# EAGLE design modbus_energy_meter (EAGLE 6.1)
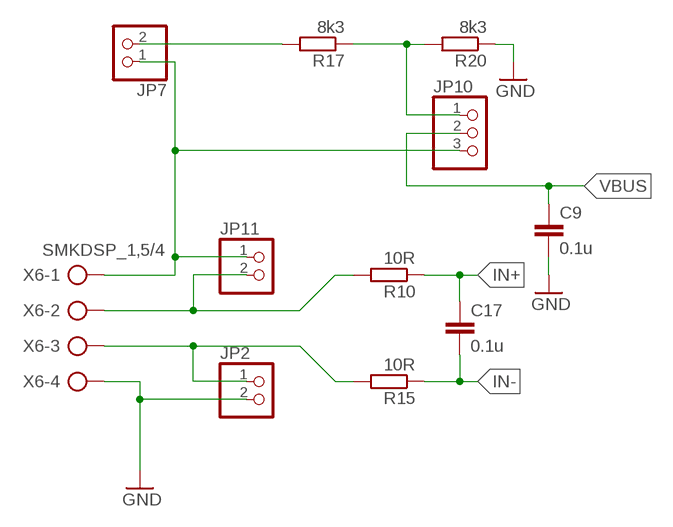
[diagram p0: schematic, sheet 1, part 1 of 2]
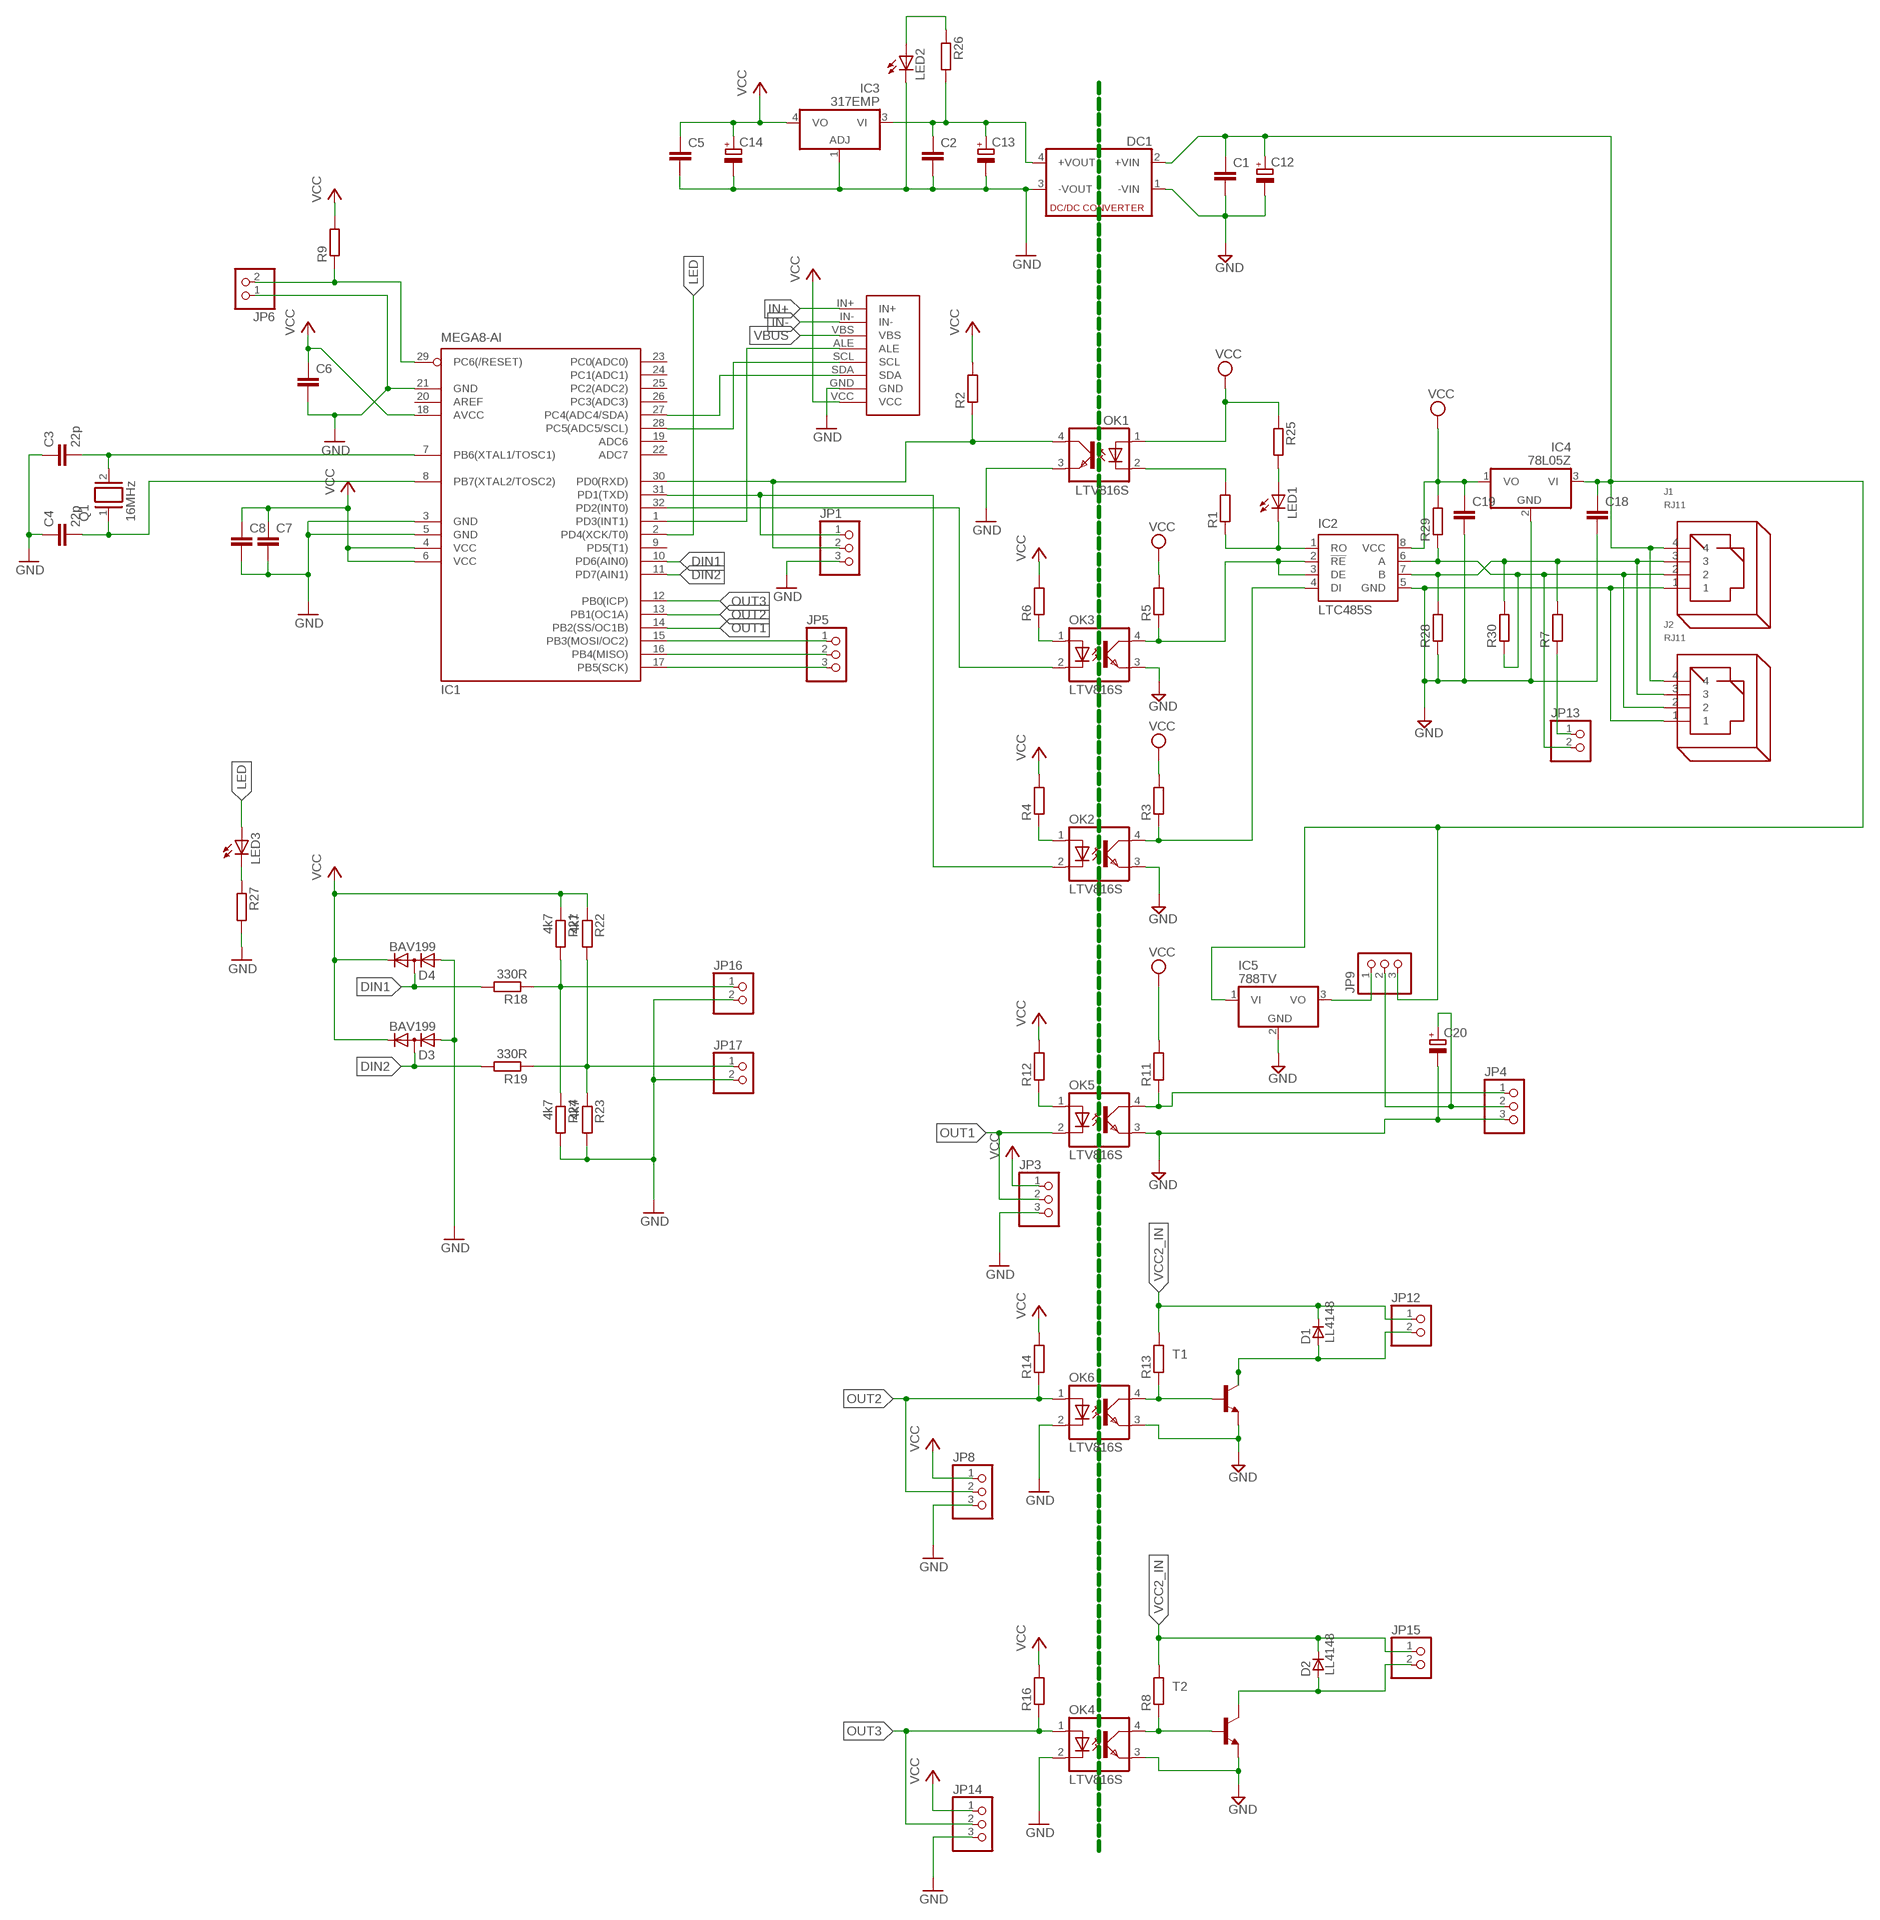
[diagram p1: schematic, sheet 1, part 2 of 2]

## Parts
C1  C-EUC0805  [C0805]
C2  C-EUC0805  [C0805]
C3  22p  C-EUC0805  [C0805]
C4  22p  C-EUC0805  [C0805]
C5  C-EUC0805  [C0805]
C6  C-EUC0805  [C0805]
C7  C-EUC0805  [C0805]
C8  C-EUC0805  [C0805]
C9  0.1u  C-EUC0805  [C0805]
C12  CPOL-EUE2.5-6  [E2,5-6]
C13  CPOL-EUE2.5-5  [E2,5-5]
C14  CPOL-EUE2.5-5  [E2,5-5]
C17  0.1u  C-EUC0805  [C0805]
C18  C-EUC0805  [C0805]
C19  C-EUC0805  [C0805]
C20  CPOL-EUE2.5-5  [E2,5-5]
D1  LL4148  [SOD80_DO213AA_MINIMELF]
D2  LL4148  [SOD80_DO213AA_MINIMELF]
D3  BAV199  [SOT23]
D4  BAV199  [SOT23]
DC1  NME  [NME]
IC1  MEGA8-AI  [TQFP32-08]
IC2  LTC485S  [SOIC8]
IC3  317EMP  [SOT223]
IC4  78L05Z  [TO92]
IC5  788TV  [TO220V]
J1  RJ11  [RJ11]
J2  RJ11  [RJ11]
JP1  PINHD-1X3  [1X03]
JP2  PINHD-1X2  [1X02]
JP3  PINHD-1X3  [1X03]
JP4  PINHD-1X3  [1X03]
JP5  PINHD-1X3  [1X03]
JP6  PINHD-1X2  [1X02]
JP7  PINHD-1X2  [1X02]
JP8  PINHD-1X3  [1X03]
JP9  PINHD-1X3  [1X03]
JP10  PINHD-1X3  [1X03]
JP11  PINHD-1X2  [1X02]
JP12  PINHD-1X2  [1X02]
JP13  PINHD-1X2  [1X02]
JP14  PINHD-1X3  [1X03]
JP15  PINHD-1X2  [1X02]
JP16  PINHD-1X2  [1X02]
JP17  PINHD-1X2  [1X02]
LED1  LEDCHIPLED_0805  [CHIPLED_0805]
LED2  LEDCHIPLED_0805  [CHIPLED_0805]
LED3  LEDCHIPLED_0805  [CHIPLED_0805]
OK1  LTV816S  [SMD4]
OK2  LTV816S  [SMD4]
OK3  LTV816S  [SMD4]
OK4  LTV816S  [SMD4]
OK5  LTV816S  [SMD4]
OK6  LTV816S  [SMD4]
Q1  16MHz  XTAL/S  [QS]
R1  R-EU_R1206  [R1206]
R2  R-EU_R0805  [R0805]
R3  R-EU_R0805  [R0805]
R4  R-EU_R0805  [R0805]
R5  R-EU_R0805  [R0805]
R6  R-EU_R1206  [R1206]
R7  R-EU_R0805  [R0805]
R8  R-EU_R0805  [R0805]
R9  R-EU_R0805  [R0805]
R10  10R  R-EU_R0805  [R0805]
R11  R-EU_R0805  [R0805]
R12  R-EU_R0805  [R0805]
R13  R-EU_R0805  [R0805]
R14  R-EU_R0805  [R0805]
R15  10R  R-EU_R0805  [R0805]
R16  R-EU_R0805  [R0805]
R17  8k3  R-EU_R0805  [R0805]
R18  330R  R-EU_R0805  [R0805]
R19  330R  R-EU_R0805  [R0805]
R20  8k3  R-EU_R0805  [R0805]
R21  4k7  R-EU_R0805  [R0805]
R22  4k7  R-EU_R0805  [R0805]
R23  4k7  R-EU_R0805  [R0805]
R24  4k7  R-EU_R0805  [R0805]
R25  R-EU_R0805  [R0805]
R26  R-EU_R0805  [R0805]
R27  R-EU_R0805  [R0805]
R28  R-EU_R1206  [R1206]
R29  R-EU_R1206  [R1206]
R30  R-EU_R0805  [R0805]
T1  BC818-NPN-SOT23-BEC  [SOT23-BEC]
T2  BC818-NPN-SOT23-BEC  [SOT23-BEC]
U$1  INA226MODULE  [INA226MODULE]
X6  SMKDSP_1,5/4  [SMKDSP_1,5/4]

## Nets
A: IC2.6(A) J1.2 J2.2 JP13.2 R29.1 R30.1
B: IC2.7(B) J1.3 J2.3 R7.2 R28.2 R30.2
DI: IC2.4(DI) OK2.4(COL) R3.1
DI_CTRL: IC1.31(PD1(TXD)) JP1.1 OK2.2(C)
DIN1: D4.3(AC) IC1.10(PD6(AIN0)) R18.2
DIN2: D3.3(AC) IC1.11(PD7(AIN1)) R19.2
DIR: IC2.2(!RE) IC2.3(DE) OK3.4(COL) R5.1
DIR_CTRL: IC1.32(PD2(INT0)) OK3.2(C)
GND: C2.2 C3.1 C4.1 C5.2 C6.2 C7.2 C8.2 C9.2 C13.- C14.- D3.1(A) D4.1(A) DC1.3(-VOUT) IC1.3(GND) IC1.5(GND) IC1.21(GND) IC3.1(ADJ) JP1.3 JP2.2 JP3.3 JP6.1 JP8.3 JP14.3 JP16.2 JP17.2 LED2.C OK1.3(EMIT) OK4.2(C) OK6.2(C) R20.1 R23.2 R24.2 R27.2 U$1.GND X6.4
GND2: C1.2 C12.- C18.2 C19.2 C20.- DC1.1(-VIN) IC2.5(GND) IC4.2(GND) IC5.2(GND) J1.1 J2.1 JP4.3 OK2.3(EMIT) OK3.3(EMIT) OK4.3(EMIT) OK5.3(EMIT) OK6.3(EMIT) R28.1 T1.E T2.E ; supply symbol labelled GND
IN+: C17.1 R10.1 U$1.IN+
IN+_IN: JP11.2 R10.2 X6.2
IN-: C17.2 R15.1 U$1.IN-
IN-_IN: JP2.1 R15.2 X6.3
LED: IC1.2(PD4(XCK/T0)) LED3.A
N$1: IC1.1(PD3(INT1)) U$1.ALE
N$2: C3.2 IC1.7(PB6(XTAL1/TOSC1)) Q1.2
N$3: JP13.1 R7.1
N$4: JP17.1 R19.1 R22.2 R23.1
N$5: OK4.4(COL) R8.1 T2.B
N$6: C4.2 IC1.8(PB7(XTAL2/TOSC2)) Q1.1
N$7: D2.A JP15.2 T2.C
N$8: OK1.2(C) R1.2
N$9: IC1.15(PB3(MOSI/OC2)) JP5.1
N$10: JP16.1 R18.1 R21.2 R24.1
N$11: LED3.C R27.1
N$12: OK2.1(A) R4.1
N$14: OK3.1(A) R6.1
N$15: LED2.A R26.1
N$16: IC1.16(PB4(MISO)) JP5.2
N$17: IC1.17(PB5(SCK)) JP5.3
N$18: LED1.A R25.2
N$19: D1.A JP12.2 T1.C
N$22: OK5.1(A) R12.1
N$23: OK6.4(COL) R13.1 T1.B
N$29: JP7.2 R17.2
OUT1: IC1.14(PB2(SS/OC1B)) JP3.2 OK5.2(C)
OUT1_SIGNAL: JP4.1 OK5.4(COL) R11.1
OUT1_VCC: C20.+ JP4.2 JP9.2
OUT1_VCC_STAB: IC5.3(VO) JP9.1
OUT2: IC1.13(PB1(OC1A)) JP8.2 OK6.1(A) R14.1
OUT3: IC1.12(PB0(ICP)) JP14.2 OK4.1(A) R16.1
RO: IC2.1(RO) LED1.C R1.1
RO_CTRL: IC1.30(PD0(RXD)) JP1.2 OK1.4(COL) R2.1
RST: IC1.29(PC6(/RESET)) JP6.2 R9.1
SCL: IC1.28(PC5(ADC5/SCL)) U$1.SCL
SDA: IC1.27(PC4(ADC4/SDA)) U$1.SDA
VBUS: C9.1 JP10.2 U$1.VBS
VBUS_DIVIDED: JP10.1 R17.1 R20.2
VBUS_IN: JP7.1 JP10.3 JP11.1 X6.1
VCC: C5.1 C6.1 C7.1 C8.1 C14.+ D3.2(C) D4.2(C) IC1.4(VCC) IC1.6(VCC) IC1.18(AVCC) IC3.4(VO) JP3.1 JP8.1 JP14.1 R2.2 R4.2 R6.2 R9.2 R12.2 R14.2 R16.2 R21.1 R22.1 U$1.VCC
VCC2: C19.1 IC2.8(VCC) IC4.1(VO) OK1.1(A) R3.2 R5.2 R11.2 R25.1 R29.2 ; supply symbol labelled VCC
VCC2_IN: C1.1 C12.+ C18.1 D1.C D2.C DC1.2(+VIN) IC4.3(VI) IC5.1(VI) J1.4 J2.4 JP9.3 JP12.1 JP15.1 R8.2 R13.2
VCC5V: C2.1 C13.+ DC1.4(+VOUT) IC3.3(VI) R26.2
Unconnected: IC1.9(PD5(T1)) IC1.19(ADC6) IC1.20(AREF) IC1.22(ADC7) IC1.23(PC0(ADC0)) IC1.24(PC1(ADC1)) IC1.25(PC2(ADC2)) IC1.26(PC3(ADC3))

## Library data of the parts
C1-C9 C17-C19 = rcl-kd:C-EU: CAPACITOR, European symbol
C12-C14 C20 = rcl-kd:CPOL-EU: POLARIZED CAPACITOR, European symbol
D1 D2 = _hhn_diodes_smd:LL4148: 1N4148 General Purpose Rectifie SMD-Version of 1N4148 Case: SOD 80 = DO 213 AA = MINIMELF (Glass) Author: Dipl.-Ing. FH Rainer Bayer HHN Hochschule Heilbronn, rainer.bayer@hs-heilbronn.de Ingenieurbüro ing-rb, mail@ing-rb.de
D3 D4 = diode:BAV199: DIODE low-leakage double diode
DC1 = dc-dc-converter:NME: DC-DC CONVERTER; MF: C & D TECHNOLOGIES, INC; MPN: NME1205D; OC_FARNELL: 1021466; OC_NEWARK: 98B8198
IC1 = atmel:MEGA8: MICROCONTROLLER 8 Kbytes FLASH, 1 kbytes SRAM, 512 bytes EEPROM, USART, 6-channel 10 bit ADC, 2-channel 8 bit ADC Pin compatible with Atmega48, ATMega88, ATMega168 Source: avr.lbr; MPN: ATMEGA8-16AU; OC_FARNELL: 9171371; OC_NEWARK: 73M8863
IC2 = linear-technology:LTC485: Low Power RS485 Interface Transceiver Source: http://www.linear.com/pc/downloadDocument.do?navId=H0,C1,C1007,C1017,P2064,D1718; OC_FARNELL: unknown; OC_NEWARK: unknown
IC3 = linear-kd:*317: Positive VOLTAGE REGULATOR
IC4 = linear:78*: Positive VOLTAGE REGULATOR Source: http://cache.national.com/ds/LM/LM78L05.pdf http://www.fairchildsemi.com/ds/LM/LM7805.pdf
IC5 = linear-kd:78*: Positive VOLTAGE REGULATOR Source: http://cache.national.com/ds/LM/LM78L05.pdf http://www.fairchildsemi.com/ds/LM/LM7805.pdf
J1 J2 = con-rj:RJ11: RJ11, RJ22 RJ11 and RJ22 jacks side mounted http://www.tycoelectronics.com
JP1 JP3-JP5 JP8-JP10 JP14 = pinhead-kd:PINHD-1X3: PIN HEADER
JP2 JP6 JP7 JP11-JP13 JP15-JP17 = pinhead-kd:PINHD-1X2: PIN HEADER
LED1-LED3 = led:LED: LED OSRAM: - CHIPLED LG R971, LG N971, LY N971, LG Q971, LY Q971, LO R971, LY R971 LH N974, LH R974 LS Q976, LO Q976, LY Q976 LO Q996 - Hyper CHIPLED LW Q18S LB Q993, LB Q99A, LB R99A - SideLED LS A670, LO A670, LY A670, LG A670, LP A670 LB A673, LV A673, LT A673, LW A673 LH A674 LY A675 LS A676, LA A676, LO A676, LY A676, LW A676 LS A679, LY A679, LG A679 - Hyper Micro SIDELED® LS Y876, LA Y876, LO Y876, LY Y876 LT Y87S - SmartLED LW L88C, LW L88S LB L89C, LB L89S, LG L890 LS L89K, LO L89K, LY L89K LS L896, LA L896, LO L896, LY L896 - TOPLED LS T670, LO T670, LY T670, LG T670, LP T670 LSG T670, LSP T670, LSY T670, LOP T670, LYG T670 LG T671, LOG T671, LSG T671 LB T673, LV T673, LT T673, LW T673 LH T674 LS T676, LA T676, LO T676, LY T676, LB T676, LH T676, LSB T676, LW T676 LB T67C, LV T67C, LT T67C, LS T67K, LO T67K, LY T67K, LW E67C LS E67B, LA E67B, LO E67B, LY E67B, LB E67C, LV E67C, LT E67C LW T67C LS T679, LY T679, LG T679 LS T770, LO T770, LY T770, LG T770, LP T770 LB T773, LV T773, LT T773, LW T773 LH T774 LS E675, LA E675, LY E675, LS T675 LS T776, LA T776, LO T776, LY T776, LB T776 LHGB T686 LT T68C, LB T68C - Hyper Mini TOPLED® LB M676 - Mini TOPLED Santana® LG M470 LS M47K, LO M47K, LY M47K Source: http://www.osram.convergy.de LUXEON: - LUMILED® LXK2-PW12-R00, LXK2-PW12-S00, LXK2-PW14-U00, LXK2-PW14-V00 LXK2-PM12-R00, LXK2-PM12-S00, LXK2-PM14-U00 LXK2-PE12-Q00, LXK2-PE12-R00, LXK2-PE12-S00, LXK2-PE14-T00, LXK2-PE14-U00 LXK2-PB12-K00, LXK2-PB12-L00, LXK2-PB12-M00, LXK2-PB14-N00, LXK2-PB14-P00, LXK2-PB14-Q00 LXK2-PR12-L00, LXK2-PR12-M00, LXK2-PR14-Q00, LXK2-PR14-R00 LXK2-PD12-Q00, LXK2-PD12-R00, LXK2-PD12-S00 LXK2-PH12-R00, LXK2-PH12-S00 LXK2-PL12-P00, LXK2-PL12-Q00, LXK2-PL12-R00 Source: www.luxeon.com KINGBRIGHT: KA-3528ASYC Source: www.kingbright.com
OK1-OK6 = optocoupler:LTV816: OPTO COUPLER Source: LITEON, LTV816.pdf; OC_FARNELL: unknown; OC_NEWARK: unknown
Q1 = special-kd:XTAL/S: CRYSTAL
R1-R30 = rcl-kd:R-EU_: RESISTOR, European symbol
T1 T2 = transistor:*-NPN-: NPN Transistror BF959 corrected 2008.03.06
U$1 = kd:INA226MODULE
X6 = con-phoenix-smkdsp:SMKDSP_1,5/4: Printklemme, Nennstrom: 17,5 A, Bemessungsspannung: 250 V, Raster: 5,0 mm Source: http://eshop.phoenixcontact.de .. 1733415.pdf; MF: FARNELL; MPN: 1733596; OC_FARNELL: 3041268; OC_NEWARK: 71C4131

## Board
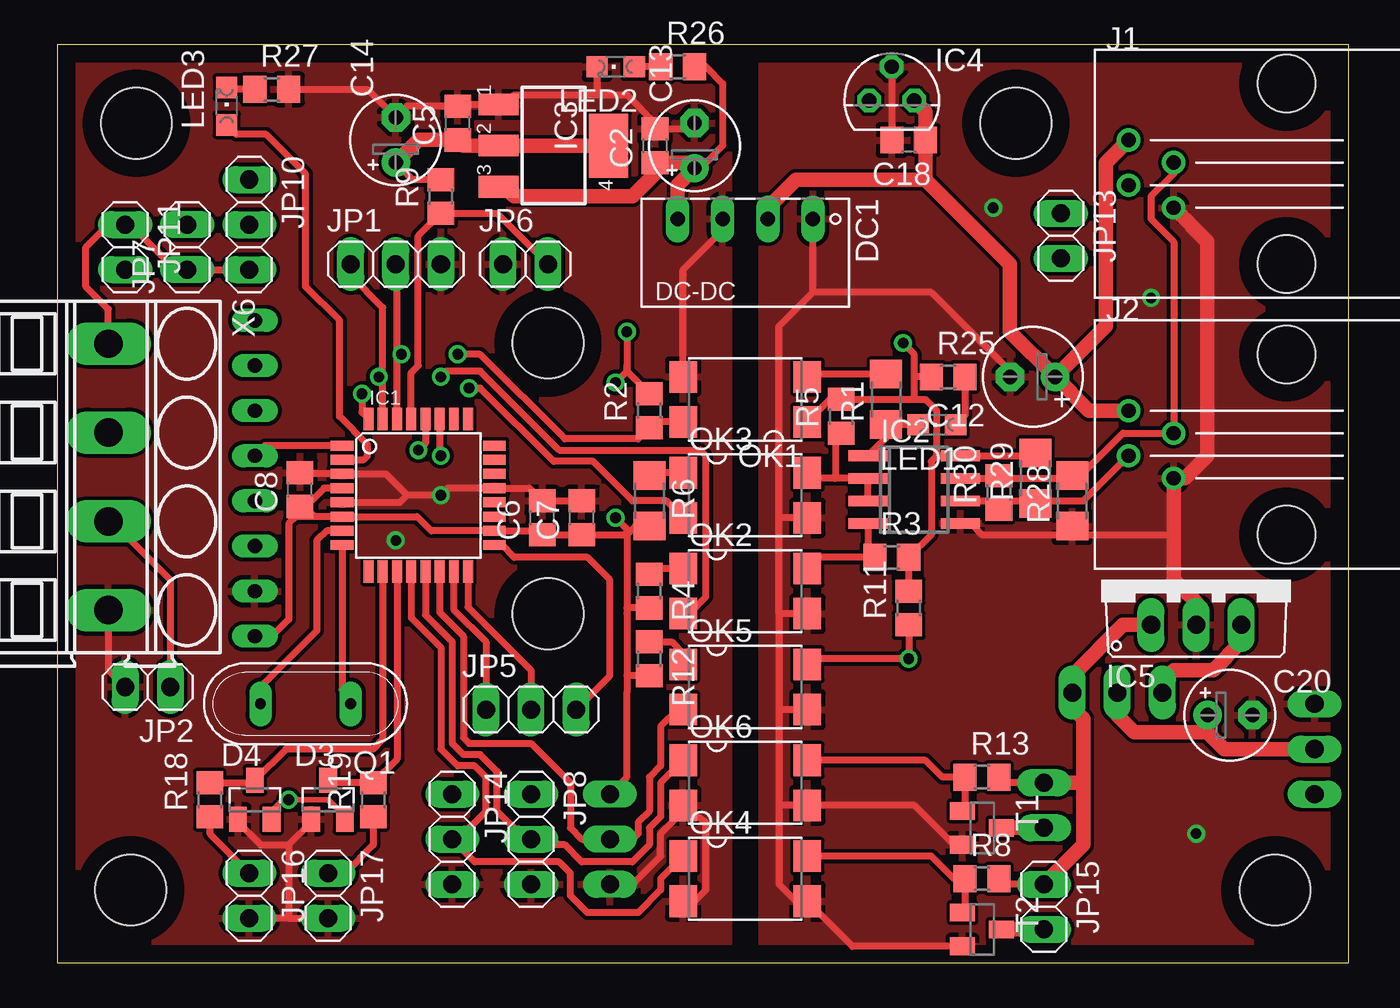
[diagram p2: board, top side]
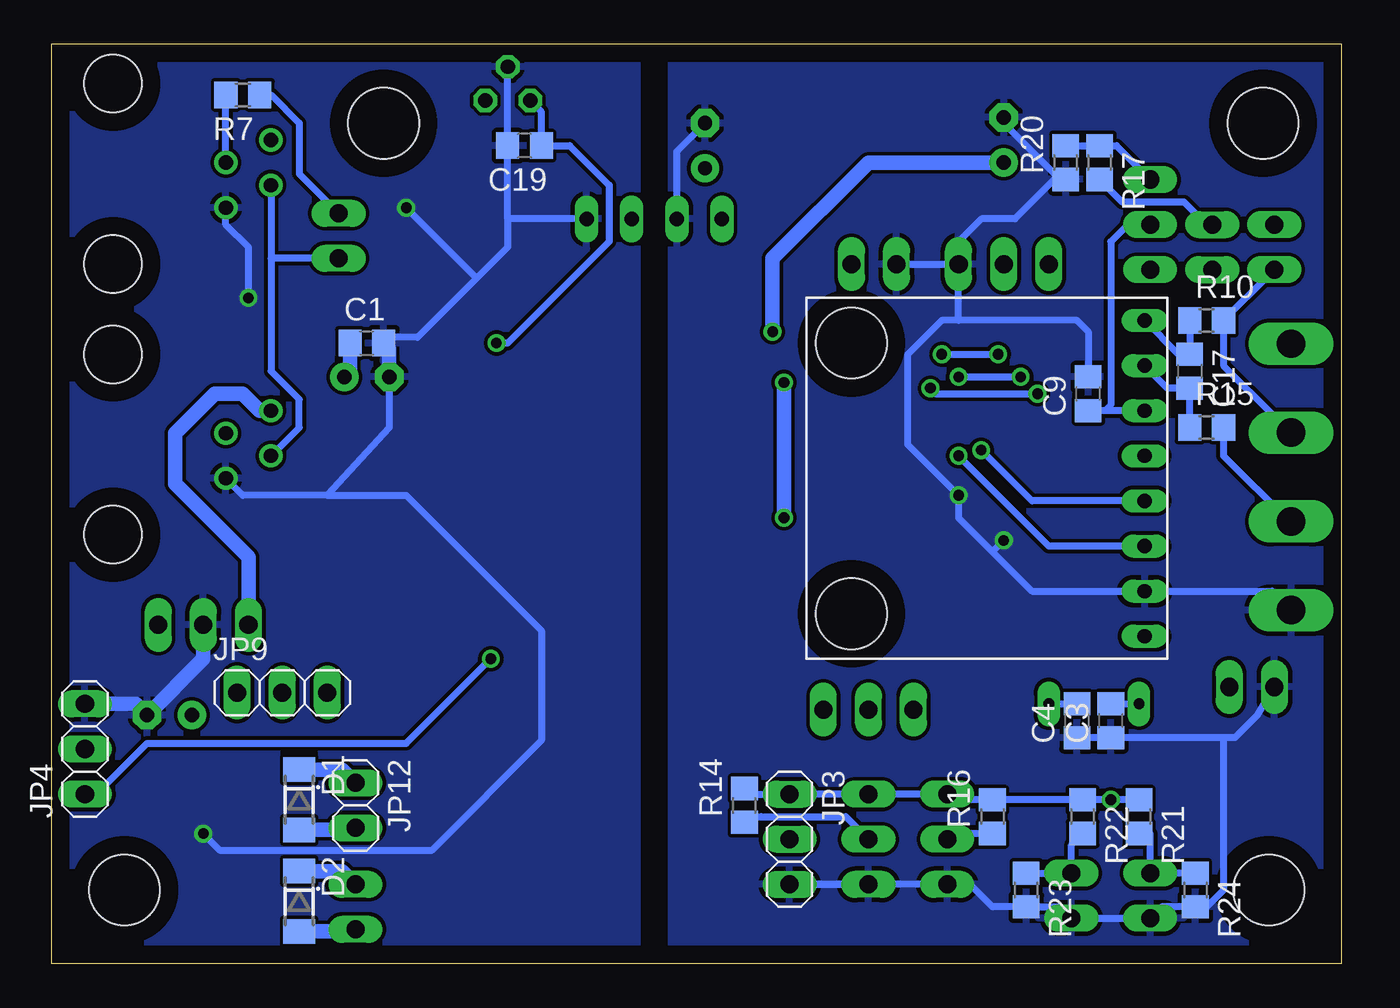
[diagram p3: board, bottom side, seen from below]

Size 72.69 x 51.74 mm. Coordinates in mm from the lower left corner, seen from the top.
Outline: 72.69,0 0,0 0,51.74 72.69,51.74 72.69,0
Copper layers (1*16): Top 0.035mm / dielectric 1.5mm / Bottom 0.035mm
Design rules: minimum track width 10mil, minimum drill 24mil, track to track 8mil, track to pad 8mil, pad to pad 8mil, via to via 8mil, smd to smd 8mil, copper to edge 40mil, drill to drill 8mil, minimum pad ring 10mil, minimum via ring 8mil, stop-mask expansion 4mil, vias tented up to drill 0mil, thermal gap 10mil
Holes 4 mm at 4.43,47.31 53.95,47.31 68.56,4.13 4.11,4.13

### Footprints (pad centres in the part's own frame; a part is rotated, then mirrored left to right if it is on the bottom)
C0805 = smd 1.3 x 1.5: 1 -0.95,0; 2 0.95,0
E2,5-6 = drill 0.813 pad 1.6: + -1.27,0 | drill 0.813 pad 1.6 octagon: - 1.27,0
E2,5-5 = drill 0.813 pad 1.6: + -1.27,0 | drill 0.813 pad 1.6 octagon: - 1.27,0
SOD80_DO213AA_MINIMELF = smd 1.4 x 1.8: A 1.7,0; C -1.7,0
SOT23 = smd 1 x 1.4: 1 -0.95,-1.1; 2 0.95,-1.1; 3 0,1.1
NME = drill 0.813 long: 1 0,3.81; 2 0,1.27; 3 0,-1.27; 4 0,-3.81
TQFP32-08 = smd 1.27 x 0.559: 1 -4.293,2.8; 2 -4.293,2; 3 -4.293,1.2; 4 -4.293,0.4; 5 -4.293,-0.4; 6 -4.293,-1.2; 7 -4.293,-2; 8 -4.293,-2.8; 17 4.293,-2.8; 18 4.293,-2; 19 4.293,-1.2; 20 4.293,-0.4; 21 4.293,0.4; 22 4.293,1.2; 23 4.293,2; 24 4.293,2.8 | smd 0.559 x 1.27: 9 -2.8,-4.293; 10 -2,-4.293; 11 -1.2,-4.293; 12 -0.4,-4.293; 13 0.4,-4.293; 14 1.2,-4.293; 15 2,-4.293; 16 2.8,-4.293; 25 2.8,4.293; 26 2,4.293; 27 1.2,4.293; 28 0.4,4.293; 29 -0.4,4.293; 30 -1.2,4.293; 31 -2,4.293; 32 -2.8,4.293
SOIC8 = smd 0.6 x 2.2: 1 -1.905,-2.6; 2 -0.635,-2.6; 3 0.635,-2.6; 4 1.905,-2.6; 5 1.905,2.6; 6 0.635,2.6; 7 -0.635,2.6; 8 -1.905,2.6
SOT223 = smd 1.219 x 2.235: 1 -2.311,-3.099; 2 0,-3.099; 3 2.311,-3.099 | smd 3.6 x 2.2: 4 0,3.099
TO92 = drill 0.813 octagon: 1 -1.27,0; 2 0,1.905; 3 1.27,0
TO220V = drill 1.016 long: 1 -2.54,-2.54; 2 0,-2.54; 3 2.54,-2.54
RJ11 = drill 0.8: 1 -3.81,-2.54; 2 -6.35,-1.27; 3 -3.81,0; 4 -6.35,1.27 | hole 3.25: 2.54,-5.715; 2.54,4.445
1X03 = drill 1.016 long: 1 -2.54,0; 2 0,0; 3 2.54,0
1X02 = drill 1.016 long: 1 -1.27,0; 2 1.27,0
CHIPLED_0805 = smd 1.2 x 1.2: A 0,-1.05; C 0,1.05
SMD4 = smd 1.78 x 1.55: 1 -1.27,-3.5; 2 1.27,-3.5; 3 1.27,3.5; 4 -1.27,3.5
QS = drill 0.61 pad 1.27 long: 1 -2.54,0; 2 2.54,0
R1206 = smd 1.6 x 1.803: 1 -1.422,0; 2 1.422,0
R0805 = smd 1.3 x 1.5: 1 -0.95,0; 2 0.95,0
SOT23-BEC = smd 1 x 1.4: B -0.95,-1.1; C 0,1.1; E 0.95,-1.1
INA226MODULE = drill 0.8 long: ALE 8.89,1.27; GND 8.89,-6.35; IN+ 8.89,8.89; IN- 8.89,6.35; SCL 8.89,-1.27; SDA 8.89,-3.81; VBS 8.89,3.81; VCC 8.89,-8.89 | hole 4: -7.62,7.62; -7.62,-7.62
SMKDSP_1,5/4 = drill 1.6 pad 1.8 long: 1 -2.5,0; 2 2.5,0; 3 7.5,0; 4 12.5,0

### Placement (x,y rotation side)
C1  54.91,34.92 0 bottom
C2  33.63,46.04 90 top
C3  13,13.65 90 bottom
C4  14.9,13.65 90 bottom
C5  22.52,47.31 90 top
C6  27.29,25.08 90 top
C7  29.51,25.08 90 top
C8  13.63,26.67 90 top
C9  14.27,32.07 90 bottom
C12  54.91,33.02 180 top
C13  35.86,46.04 90 top
C14  19.03,46.35 90 top
C17  8.55,33.34 270 bottom
C18  47.92,46.35 180 top
C19  46.02,46.04 180 bottom
C20  66.02,13.97 0 top
D1  58.72,9.21 270 bottom
D2  58.72,3.49 270 bottom
D3  15.22,9.21 0 top
D4  11.09,9.21 0 top
DC1  38.71,41.91 270 top
IC1  20.3,26.35 0 top
IC2  48.24,26.67 270 top
IC3  27.92,46.04 270 top
IC4  46.97,48.58 0 top
IC5  64.12,21.59 0 top
J1  66.66,45.09 0 top
J2  66.66,29.84 0 top
JP1  19.03,39.37 0 top
JP2  5.06,15.56 180 top
JP3  31.09,6.99 270 bottom
JP4  70.78,12.06 90 bottom
JP5  26.65,14.29 0 top
JP6  26.33,39.37 0 top
JP7  7.28,40.32 90 top
JP8  26.65,6.99 270 top
JP9  59.67,15.24 0 bottom
JP10  10.78,41.59 270 top
JP11  3.79,40.32 270 top
JP12  55.54,8.89 270 bottom
JP13  56.49,40.96 270 top
JP14  22.21,6.99 270 top
JP15  55.54,3.17 270 top
JP16  10.78,3.81 270 top
JP17  15.22,3.81 270 top
LED1  49.51,30.32 90 top
LED2  31.41,50.48 90 top
LED3  9.51,48.26 0 top
OK1  38.71,31.75 90 top
OK2  38.71,20.95 270 top
OK3  38.71,26.35 270 top
OK4  38.71,4.76 270 top
OK5  38.71,15.56 270 top
OK6  38.71,10.16 270 top
Q1  13.95,14.61 180 top
R1  46.65,31.75 90 top
R2  33.32,31.11 90 top
R3  46.97,22.86 0 top
R4  33.32,20.95 270 top
R5  44.11,30.8 90 top
R6  33.32,26.04 270 top
R7  61.89,48.9 180 bottom
R8  52.05,4.76 0 top
R9  21.57,43.18 90 top
R10  7.6,36.2 0 bottom
R11  47.92,20 90 top
R12  33.32,17.14 270 top
R13  52.05,10.48 0 top
R14  33.63,8.89 90 bottom
R15  7.6,30.16 0 bottom
R16  19.66,8.26 90 bottom
R17  13.63,45.09 270 bottom
R18  8.55,9.21 90 top
R19  17.76,9.21 90 top
R20  15.54,45.09 90 bottom
R21  11.41,8.26 270 bottom
R22  14.59,8.26 270 bottom
R23  17.76,4.13 270 bottom
R24  8.24,4.13 270 bottom
R25  50.14,33.02 0 top
R26  34.9,50.48 0 top
R27  12.04,49.21 0 top
R28  57.13,26.04 90 top
R29  55.07,27.3 90 top
R30  53,26.51 90 top
T1  52.05,7.62 270 top
T2  52.05,1.91 270 top
U$1  19.98,27.3 0 bottom
X6  2.84,32.38 270 top

### Tracks (layer width: path | path; a pad name or v marks a point on that pad's centre or on a via)
A
  Top 0.406: IC2.6 53,26.04 | 53,26.04 54.91,26.04 | 54.91,26.04 57.76,26.04 J2.2 | R29.1 54.91,26.04 | R30.1 53,26.04
  Bottom 0.406: J1.2 60.3,39.69 | 60.3,39.69 60.3,33.34 58.72,31.75 58.72,30.16 J2.2 | JP13.2 60.3,39.69
B
  Top 0.406: J1.3 62.84,44.45 61.57,43.18 61.57,41.91 62.84,40.64 J2.3 59.99,29.84 57.45,27.3 57.13,27.3 | IC2.7 53,27.3 | 53,27.3 57.13,27.3 | R28.2 57.13,27.3 | R30.2 53,27.3
  Bottom 0.406: J1.3 R7.2
DI
  Top 0.406: IC2.4 45.64,22.92 R3.1 42.85,22.86 OK2.4
DI_CTRL  (via drill 0.6)
  Top 0.406: IC1.31 18.3,33.02 | 18.3,33.02 18.3,36.92 16.49,38.73 JP1.1 | OK2.2 35.54,19.68 36.49,20.64 36.49,28.57 36.17,28.89 28.24,28.89 23.79,33.34 21.89,33.34 v21.57,33.02 | v18.08,33.02 18.3,33.02
  Bottom 0.406: v21.57,33.02 v18.08,33.02
DIN1
  Top 0.406: R18.2 10.94,10.16 D4.3 12.85,12.06 17.76,12.06 18.3,12.61 IC1.10
DIN2
  Top 0.406: D3.3 15.37,10.16 R19.2 19.1,11.5 IC1.11
DIR
  Top 0.406: IC2.3 IC2.2 43.79,27.3 | 43.79,27.3 42.53,27.3 OK3.4 | R5.1 44.43,30.16 43.79,29.53 43.79,27.3
DIR_CTRL  (via drill 0.6)
  Top 0.406: OK3.2 34.27,26.04 32.36,26.04 30.14,28.26 27.92,28.26 23.79,32.38 v23.16,32.38 | v17.12,32.07 17.12,31.02 IC1.32
  Bottom 0.406: v23.16,32.38 22.84,32.07 v17.12,32.07
GND  (via drill 0.6)
  Top 0.406: 19.66,26.35 v21.57,26.35 21.97,26.75 IC1.21 26.57,26.75 C6.2 C7.2 | 19.66,26.35 18.46,27.55 IC1.3 13.7,27.55 C8.2 | IC1.5 19.27,25.95 19.66,26.35 | DC1.3 37.45,41.27 35.22,39.05 35.21,38.74 OK1.3 | 30.46,48.9 25.7,48.9 25.15,48.35 IC3.1 22.61,48.35 C5.2 19.66,48.26 C14.- 17.44,49.21 R27.2 | 30.46,48.9 32.05,48.9 33.63,47.31 C2.2 35.54,46.99 C13.- | X6.4 2.84,16.51 JP2.2 | 35.54,8.57 34.9,8.26 33.95,7.3 33.95,6.03 32.36,4.45 JP3.3 | 35.54,8.57 34.9,8.9 OK6.2 35.54,8.57 | OK4.2 35.86,3.49 36.49,4.13 36.49,7.94 35.54,8.57 | D4.1 10.14,7.93 11.41,6.67 13,6.67 | D3.1 14.27,7.94 13,6.67 | 13,6.67 13,2.54 | 13,2.54 JP16.2 | 13,2.54 JP17.2 | LED2.C 30.36,48.99 30.46,48.9
  Bottom 0.406: 21.57,36.2 14.91,36.2 14.27,35.56 C9.2 | 21.57,36.2 JP1.3 | X6.4 3.91,20.95 U$1.GND 17.44,20.95 19.66,23.18 | 19.66,23.18 21.57,25.08 v21.57,26.35 24.43,29.21 24.43,34.29 22.52,36.2 21.57,36.2 | C3.1 13,12.38 | JP2.2 4.74,13.97 6.01,12.7 6.65,12.7 | C3.1 14.27,12.7 | 14.27,12.7 C4.1 | 15.86,44.45 16.17,44.45 19.03,47.31 C14.- | 15.86,44.45 R20.1 | v19.03,23.81 19.66,23.18 | JP6.1 JP1.3 | 15.86,44.45 18.39,41.91 20.3,41.91 21.57,40.64 JP1.3 | 6.65,12.7 C3.1 | JP8.3 JP3.3 JP14.3 20.93,4.45 19.67,3.18 R23.2 15.86,3.18 JP17.2 JP16.2 10.14,3.18 R24.2 7.6,3.18 6.65,4.13 6.65,12.7 | 15.22,12.7 14.27,12.7 | DC1.3 37.45,45.72 C13.-
  pour Bottom: -0.02,51.75 37.76,51.75 37.76,0 -0.02,0
  pour Top: -0.02,51.75 37.76,51.75 37.76,0 -0.02,0
GND2  (via drill 0.6)
  Top 0.406: J2.1 63.48,27.3 | 41.89,24.77 OK3.3 40.62,25.08 | 40.62,19.68 40.62,14.29 | OK5.3 40.62,14.29 | OK2.3 40.62,19.68 | 40.62,19.68 40.62,25.08 | 40.62,25.08 40.62,35.88 42.52,37.78 | 42.52,37.78 DC1.1 | IC4.2 C18.2 C19.2 C18.2 | 42.52,37.78 49.19,37.78 53.64,33.34 C12.- | IC2.5 51.41,24.77 52.05,24.13 56.81,24.13 | 56.81,24.13 62.53,24.13 62.84,24.45 62.84,24.77 | 40.62,14.29 40.62,8.89 | 40.62,8.89 40.62,4.45 41.57,3.49 OK4.3 44.75,0.95 T2.E | T1.E 50.46,6.67 48.24,8.89 OK6.3 40.62,8.89 | R28.1 57.13,24.45 56.81,24.13
  Top 0.813: 63.48,27.3 64.75,28.57 64.75,40.64 J1.1 | J2.1 62.84,24.77 62.84,21.59 64.12,20.32 IC5.2
  Bottom 0.406: DC1.1 46.97,41.91 | 46.97,41.91 46.97,40.32 48.72,38.58 | 46.97,41.91 C19.2 | C19.2 IC4.2 | 48.72,38.58 52.05,35.24 53.64,35.24 | C19.2 | 57.13,26.35 53.64,30.16 C12.- | 57.13,26.35 61.89,26.35 J2.1 | v52.68,42.55 48.72,38.58 | v61.57,37.47 61.57,40.32 62.84,41.59 J1.1 | 57.13,26.35 52.68,26.35 45.06,18.73 45.06,12.55 51.27,6.35 63.16,6.35 v64.12,7.3
  Bottom 0.813: JP4.3 67.92,14.61 C20.- 64.12,17.14 IC5.2 | C12.- 53.64,34.6 C1.2 53.64,35.24
  pour Top: 39.67,51.75 72.69,51.75 72.69,0 39.67,0
  pour Bottom: 39.67,51.75 72.69,51.75 72.69,0 39.67,0
IN+
  Bottom 0.406: U$1.IN+ 9.19,34.29 C17.1 R10.1
IN+_IN
  Bottom 0.406: X6.2 3.79,30.8 6.65,33.66 R10.2 4.11,38.74 JP11.2
IN-
  Bottom 0.406: U$1.IN- 9.83,32.39 C17.2 R15.1
IN-_IN  (via drill 0.6)
  Top 0.406: v2.96,24.89 3.04,24.89 6.33,21.59 JP2.1
  Bottom 0.406: X6.3 v2.96,24.89 6.65,28.58 R15.2
LED
  Top 0.406: IC1.2 17.22,28.35 17.44,28.57 17.44,29.21 15.86,30.8 15.86,36.2 13.95,38.1 13.95,44.45 11.73,46.67 10.04,46.67 LED3.A
N$1
  Top 0.406: IC1.1 11.67,29.15 U$1.ALE
N$2
  Top 0.406: IC1.7 15.12,24.35 14.59,23.81 14.59,18.73 11.41,15.56 Q1.2
  Bottom 0.406: C3.2 Q1.2
N$3
  Bottom 0.406: R7.1 60.3,48.9 58.72,47.31 58.72,44.45 JP13.1
N$4
  Top 0.406: R19.1 17.76,6.67 16.17,5.08 JP17.1
  Bottom 0.406: R22.2 15.22,6.67 JP17.1 R23.1
N$5
  Top 0.406: OK4.4 49.19,6.03 50.46,4.76 R8.1 51.1,3 T2.B
N$6
  Top 0.406: IC1.8 16.01,15.4 16.49,14.92 Q1.1
  Bottom 0.406: Q1.1 C4.2
N$7
  Top 0.813: JP15.2 T2.C
  Bottom 0.813: D2.A 55.65,1.79 JP15.2
N$8
  Top 0.406: R1.2 42.37,33.17 OK1.2
N$9
  Top 0.406: IC1.15 22.3,19.91 24.11,18.1 JP5.1
N$10
  Top 0.406: R18.1 8.55,7.3 JP16.1
  Bottom 0.406: R21.2 10.78,7.3 JP16.1 R24.1
N$11
  Top 0.406: R27.1 9.6,49.21 LED3.C
N$12
  Top 0.406: OK2.1 33.32,22.23 R4.1
N$14
  Top 0.406: OK3.1 33.95,27.62 R6.1
N$15
  Top 0.406: R26.1 LED2.A
N$16
  Top 0.406: IC1.16 23.1,20.06 26.65,16.51 JP5.2
N$17
  Top 0.406: JP5.3 31.09,16.19 31.09,21.59 29.82,22.86 25.7,22.86 25,23.55 IC1.17
N$18
  Top 0.406: R25.2 51.1,30.86 LED1.A
N$19
  Top 0.813: JP12.2 T1.C
  Bottom 0.813: D1.A 55.65,7.51 JP12.2
N$22
  Top 0.406: R12.1 34.59,18.09 35.22,17.46 35.22,16.84 OK5.1
N$23
  Top 0.406: OK6.4 48.88,11.43 49.83,10.48 R13.1 51.1,8.72 T1.B
N$29
  Bottom 0.406: JP7.2 7.6,41.59 8.87,42.86 12.36,42.86 R17.2
OUT1
  Top 0.406: IC1.14 21.5,19.75 22.84,18.41 22.84,12.7 23.16,12.38 26.65,12.38 28.87,10.16 28.87,7.62 29.51,6.99 JP3.2 32.36,6.99 32.68,7.3 32.68,7.94 33.32,8.57 33.32,10.48 33.95,11.11 33.95,13.34 34.9,14.29 OK5.2 35.22,14.29
OUT1_SIGNAL  (via drill 0.6)
  Top 0.406: OK5.4 42.53,17.14 v47.92,17.14 v47.92,17.15 R11.1
  Bottom 0.406: JP4.1 70.15,9.53 67.29,12.38 52.68,12.38 v47.92,17.14
OUT1_VCC
  Top 0.813: JP4.2 65.7,12.06 64.75,13.02 | 64.75,13.02 C20.+ | JP9.2 59.67,13.97 60.62,13.02 64.75,13.02
OUT1_VCC_STAB
  Top 0.813: IC5.3 66.66,18.1 65.07,16.51 62.84,16.51 62.21,15.88 JP9.1
OUT2
  Top 0.406: IC1.13 20.7,19.61 22.21,18.1 22.21,12.38 22.84,11.75 23.79,11.75 24.75,10.79 24.75,8.57 26.33,6.99 JP8.2 26.97,6.67 28.55,6.67 29.51,5.71 32.36,5.71 33.32,6.67 33.32,7.62 33.95,8.26 33.95,10.16 34.9,11.11 34.9,11.43 OK6.1
  Bottom 0.406: R14.1 33.63,8.26 32.68,8.26 27.92,8.26 JP8.2
OUT3
  Top 0.406: OK4.1 35.22,6.03 33.95,4.76 33.95,4.13 32.68,2.86 29.82,2.86 28.87,3.81 28.87,5.08 28.24,5.71 23.48,5.71 JP14.2 22.52,6.99 24.11,8.57 24.11,10.48 23.48,11.11 22.52,11.11 21.57,12.06 21.57,17.78 19.9,19.45 IC1.12
  Bottom 0.406: R16.1 21.89,7.3 JP14.2
RO
  Top 0.406: IC2.1 46.65,29.59 R1.1 LED1.C
RO_CTRL  (via drill 0.6)
  Top 0.406: IC1.30 19.1,34.29 | 19.1,34.29 19.1,39.3 JP1.2 | OK1.4 33.64,30.48 R2.1 32.68,29.53 28.55,29.53 23.79,34.29 v22.52,34.29 | v19.35,34.29 19.1,34.29
  Bottom 0.406: v22.52,34.29 v19.35,34.29
RST
  Top 0.406: IC1.29 19.9,33.26 20.3,33.66 20.3,40.96 R9.1 24.74,42.23 JP6.2
SCL  (via drill 0.6)
  Top 0.406: IC1.28 20.7,29.29 v20.3,28.89
  Bottom 0.406: U$1.SCL 17.44,26.04 v20.3,28.89
SDA  (via drill 0.6)
  Top 0.406: IC1.27 21.5,28.64 v21.57,28.57
  Bottom 0.406: U$1.SDA 16.49,23.5 v21.57,28.57
VBUS
  Bottom 0.406: U$1.VBS 13.32,31.11 | 13.32,31.11 13.63,31.11 C9.1 | JP10.2 12.04,41.59 13,40.64 13,31.43 13.32,31.11
VBUS_DIVIDED
  Bottom 0.406: R20.2 R17.1 12.68,46.03 JP10.1
VBUS_IN
  Top 0.406: JP10.3 JP7.1 6.65,39.05 4.11,41.59 JP11.1 2.84,41.59 1.57,40.32 1.57,38.1 2.84,36.83 X6.1
VCC  (via drill 0.6)
  Top 0.305: D3.2 16.17,8.26 15.22,9.21 v13,9.21 12.68,9.21 12.04,8.57 D4.2
  Top 0.406: 14.52,25.15 IC1.6 20.23,25.15 21.03,24.35 IC1.18 27.07,24.35 C6.1 C7.1 32.04,24.13 | 14.52,25.15 C8.1 13.95,25.72 14.98,26.75 IC1.4 | R2.2 32.04,33.34 | 32.04,33.34 32.05,33.66 | 32.05,24.13 32.05,19.68 | 32.05,19.68 32.05,16.19 | 32.05,16.19 32.05,15.24 | 32.05,15.24 | R4.2 32.04,20 32.05,19.68 | 32.04,24.13 32.05,24.13 | v32.05,35.56 32.05,33.66 | 14.52,25.15 13.38,25.15 13,24.77 13,19.37 12.04,18.41 U$1.VCC | 32.05,33.66 32.05,33.34 32.04,33.34 | 32.04,33.34 v31.41,32.7 | R6.2 32.52,24.61 32.04,24.13 | 32.05,24.13 32.05,24.45 v31.41,25.08 | R12.2 32.05,16.2 32.05,16.19 | JP3.1 32.05,10.48 32.05,15.24 | R9.2 19.98,44.13 C14.+
  Top 0.813: IC3.4 22.84,46.04 C5.1 20.3,46.36 C14.+
  Bottom 0.406: JP8.1 JP3.1 | JP3.1 JP14.1 21.89,9.21 R16.2 19.34,9.21 R22.1 | 33.63,9.53 R14.2 33.32,9.52 JP3.1 | R22.1 v13,9.21 R21.1 | R22.1
  Bottom 0.813: v32.05,35.56 32.05,39.69 26.65,45.09 C14.+ | v31.41,32.7 v31.41,25.08
VCC2  (via drill 0.6)
  Top 0.406: 49.51,28.57 IC2.8 54.76,28.57 R29.2 | R11.2 R3.2 49.19,24.13 49.19,28.26 49.51,28.57 | 48.24,31.75 R5.2 43.48,31.75 OK1.1 | 48.24,31.75 48.24,33.02 | 48.24,33.02 48.24,34.29 v47.6,34.92 | 49.51,28.57 49.51,31.11 48.88,31.75 48.24,31.75 | R25.1 48.24,33.02
  Bottom 0.406: v47.6,34.92 46.97,34.92 41.25,40.64 41.25,43.81 43.48,46.04 C19.1 45.07,47.95 IC4.1
VCC2_IN
  Top 0.406: C18.1 | JP12.1 53.32,10.16 R13.2 | JP15.1 53.32,4.45 R8.2
  Top 0.813: J1.4 59.03,45.09 59.03,35.88 C12.+ | 48.88,44.13 53.63,39.37 53.63,35.56 C12.+ | IC4.3 48.87,47.95 C18.1 | DC1.2 39.98,42.55 41.57,44.13 48.88,44.13 | 48.88,44.13 C18.1 | J2.4 58.08,31.11 C12.+ | IC5.1 59.99,19.05 57.13,16.19 JP9.3 57.13,14.4 57.76,13.77 57.76,10.16 | 57.76,10.16 57.76,6.67 JP15.1 | JP12.1 57.76,10.16
  Bottom 0.813: J2.4 60.94,31.11 61.89,32.07 63.48,32.07 65.7,29.84 65.7,26.99 61.57,22.86 IC5.1 | D1.C 56.29,10.91 JP12.1 | D2.C 56.29,5.19 JP15.1 | C1.1 55.86,33.34 C12.+
VCC5V
  Top 0.406: R26.2 36.49,50.48 37.45,49.53 37.45,46.04 36.49,45.09 36.17,45.09 C13.+
  Top 0.813: DC1.4 34.9,43.81 C13.+ 35.54,45.09 C2.1 | C2.1 33.95,45.09 | IC3.3 25.15,43.73 25.7,43.18 32.36,43.18 33.63,44.45 C2.1